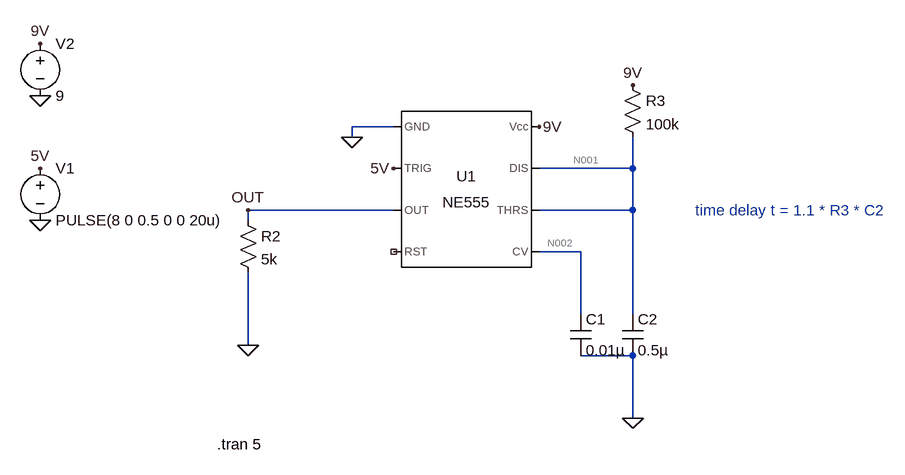
[diagram p0: schematic time delay.asc]
time delay.asc, the LTspice schematic file:
Version 4
SHEET 1 1128 680
WIRE 336 -192 272 -192
WIRE 272 -176 272 -192
WIRE 704 -128 704 -176
WIRE 704 -128 560 -128
WIRE 336 -64 112 -64
WIRE 704 -64 704 -128
WIRE 704 -64 560 -64
WIRE 112 -48 112 -64
WIRE 624 0 560 0
WIRE 624 96 624 0
WIRE 704 96 704 -64
WIRE 112 144 112 32
WIRE 704 160 624 160
WIRE 704 256 704 160
FLAG 272 -176 0
FLAG -208 -128 5V
FLAG -208 -48 0
FLAG -208 -240 0
FLAG -208 -320 9V
FLAG 560 -192 9V
FLAG 112 144 0
FLAG 704 256 0
FLAG 704 -256 9V
FLAG 336 -128 5V
FLAG 112 -64 OUT
SYMBOL voltage -208 -144 R0
WINDOW 123 0 0 Left 0
WINDOW 39 0 0 Left 0
SYMATTR InstName V1
SYMATTR Value PULSE(8 0 0.5 0 0 20u)
SYMBOL Misc\\NE555 448 -96 R0
SYMATTR InstName U1
SYMBOL voltage -208 -336 R0
WINDOW 123 0 0 Left 0
WINDOW 39 0 0 Left 0
SYMATTR InstName V2
SYMATTR Value 9
SYMBOL res 96 -64 R0
SYMATTR InstName R2
SYMATTR Value 5k
SYMBOL res 688 -272 R0
SYMATTR InstName R3
SYMATTR Value 100k
SYMBOL cap 608 96 R0
SYMATTR InstName C1
SYMATTR Value 0.01µ
SYMBOL cap 688 96 R0
SYMATTR InstName C2
SYMATTR Value 0.5µ
TEXT 64 296 Left 2 !.tran 5
TEXT 800 -64 Left 2 ;time delay t = 1.1 * R3 * C2

The netlist it stands for:
* time delay.asc
V1 5V 0 PULSE(8 0 0.5 0 0 20u)
XU1 0 5V OUT NC_01 N002 N001 N001 9V NE555  ; pins GND TRIG OUT RST CV THRS DIS Vcc
V2 9V 0 9
R2 OUT 0 5k
R3 9V N001 100k
C1 N002 0 0.01µ
C2 N001 0 0.5µ
.tran 5
* time delay t = 1.1 * R3 * C2
.lib NE555.sub
.backanno
.end

* Results of the author's LTspice run, read from the files saved beside the schematic
* Operating Point, zero values left out:
*   V(5v) = 8 V
*   V(n002) = 6 V
*   V(9v) = 9 V
*   V(n001) = 8.998 V
*   V(out) = 8.989 V
*   I(R2) = 1.798 mA
*   I(R3) = 21 nA
*   I(V1) = -8 nA
*   I(V2) = -4.705 mA
*   Ix(u1:1) = -2.907 mA
*   Ix(u1:2) = 8 nA
*   Ix(u1:3) = -1.798 mA
*   Ix(u1:6) = 8.998 nA
*   Ix(u1:7) = 12.01 nA
*   Ix(u1:8) = 4.704 mA
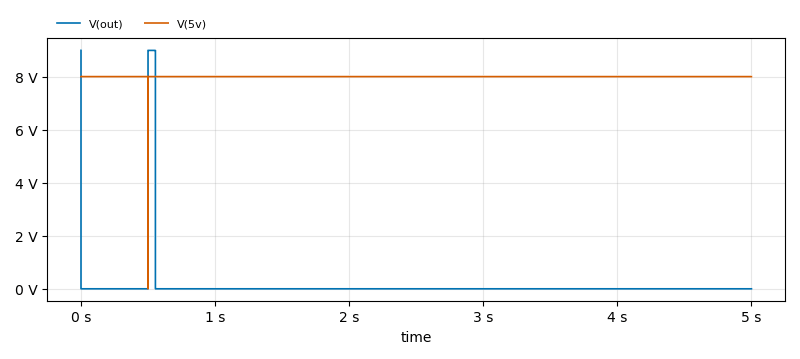
[diagram p1: Transient Analysis of time delay.asc, plotted from the saved traces]
* Transient Analysis, 1 run:
*   V(out): min 53.94 µV, max 8.989 V, average 98.78 mV, rms 942 mV, last 53.94 µV
*   V(5v): min 0 V, max 8 V, average 8 V, rms 8 V, last 8 V